# Altium project MB_AUTOMATED_TESTER.PrjPcb
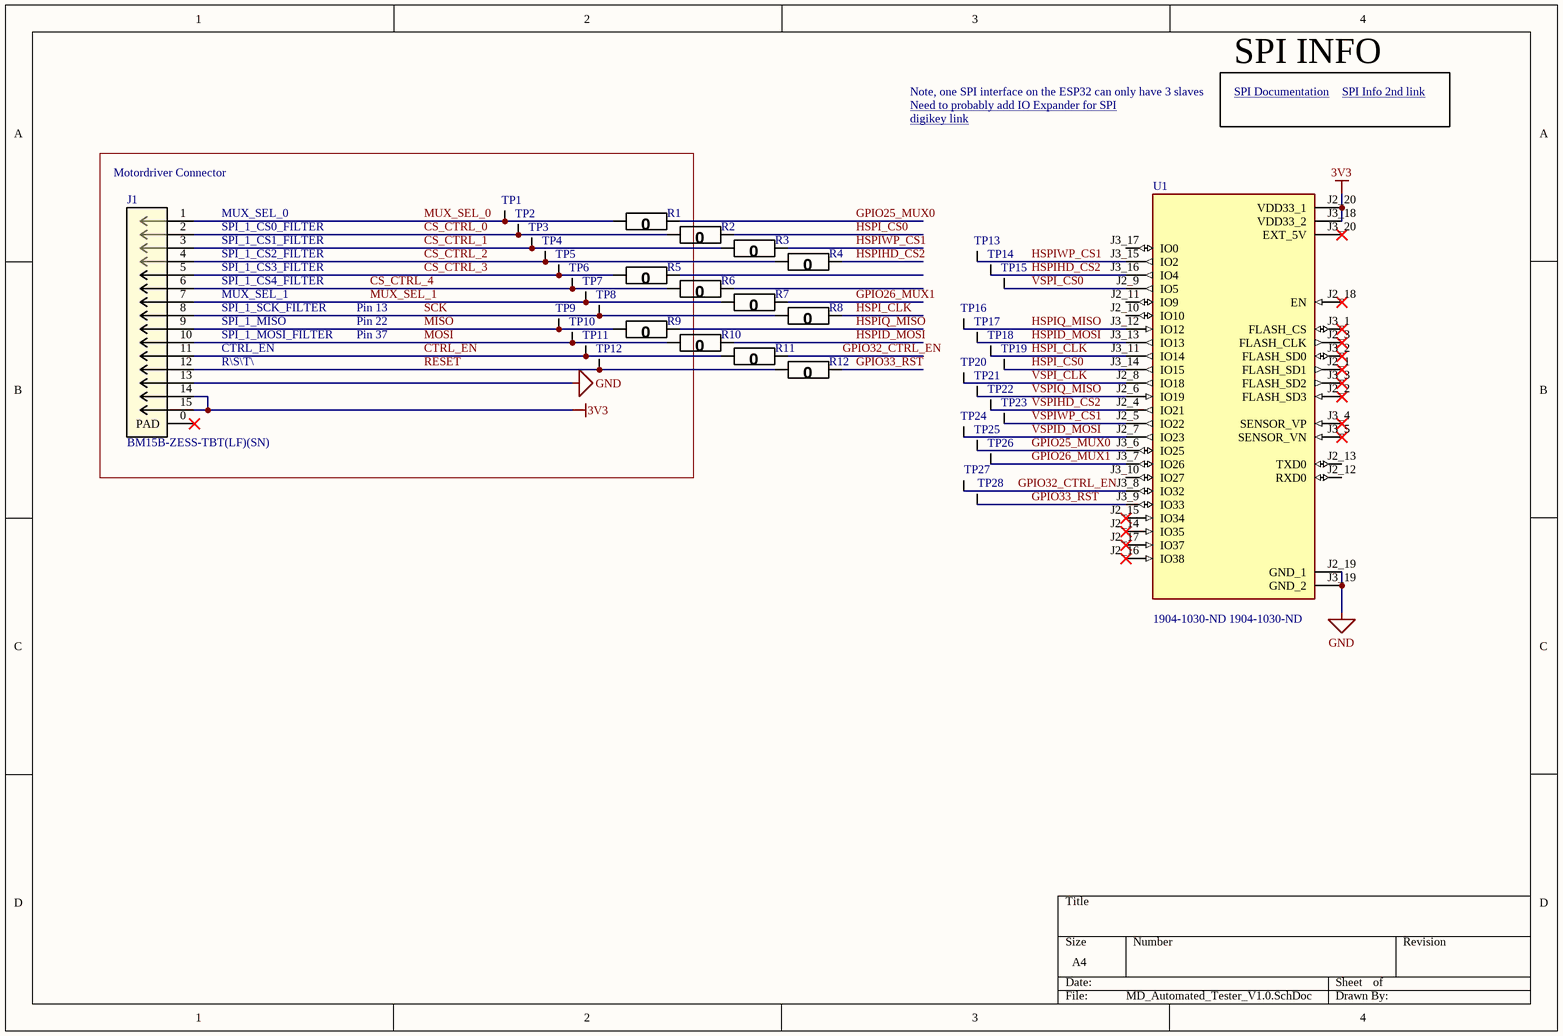
[diagram p0: MD_Automated_Tester_V1.0.SchDoc]
1 sheet, 42 parts. Net scope: global (net labels, ports and power ports of the same name join across sheets).
Board file: MD_Automated_Tester_V1.0.PcbDoc

## Sheet MD_Automated_Tester_V1.0.SchDoc
size A4; SheetNumber: 1; SheetTotal: 1

### Parts
J1  BM15B-ZESS-TBT(LF)(SN)  [JST ZE SMT 15POS]
R1  JUMPER  [0603]  (value not drawn)
R2  JUMPER  [0603]  (value not drawn)
R3  JUMPER  [0603]  (value not drawn)
R4  JUMPER  [0603]  (value not drawn)
R5  JUMPER  [0603]  (value not drawn)
R6  JUMPER  [0603]  (value not drawn)
R7  JUMPER  [0603]  (value not drawn)
R8  JUMPER  [0603]  (value not drawn)
R9  JUMPER  [0603]  (value not drawn)
R10  JUMPER  [0603]  (value not drawn)
R11  JUMPER  [0603]  (value not drawn)
R12  JUMPER  [0603]  (value not drawn)
TP1  Test Point (Via)  [TP]  (value not drawn)  (no BOM)
TP2  Test Point (Via)  [TP]  (value not drawn)  (no BOM)
TP3  Test Point (Via)  [TP]  (value not drawn)  (no BOM)
TP4  Test Point (Via)  [TP]  (value not drawn)  (no BOM)
TP5  Test Point (Via)  [TP]  (value not drawn)  (no BOM)
TP6  Test Point (Via)  [TP]  (value not drawn)  (no BOM)
TP7  Test Point (Via)  [TP]  (value not drawn)  (no BOM)
TP8  Test Point (Via)  [TP]  (value not drawn)  (no BOM)
TP9  Test Point (Via)  [TP]  (value not drawn)  (no BOM)
TP10  Test Point (Via)  [TP]  (value not drawn)  (no BOM)
TP11  Test Point (Via)  [TP]  (value not drawn)  (no BOM)
TP12  Test Point (Via)  [TP]  (value not drawn)  (no BOM)
TP13  Test Point (Via)  [TP]  (value not drawn)  (no BOM)
TP14  Test Point (Via)  [TP]  (value not drawn)  (no BOM)
TP15  Test Point (Via)  [TP]  (value not drawn)  (no BOM)
TP16  Test Point (Via)  [TP]  (value not drawn)  (no BOM)
TP17  Test Point (Via)  [TP]  (value not drawn)  (no BOM)
TP18  Test Point (Via)  [TP]  (value not drawn)  (no BOM)
TP19  Test Point (Via)  [TP]  (value not drawn)  (no BOM)
TP20  Test Point (Via)  [TP]  (value not drawn)  (no BOM)
TP21  Test Point (Via)  [TP]  (value not drawn)  (no BOM)
TP22  Test Point (Via)  [TP]  (value not drawn)  (no BOM)
TP23  Test Point (Via)  [TP]  (value not drawn)  (no BOM)
TP24  Test Point (Via)  [TP]  (value not drawn)  (no BOM)
TP25  Test Point (Via)  [TP]  (value not drawn)  (no BOM)
TP26  Test Point (Via)  [TP]  (value not drawn)  (no BOM)
TP27  Test Point (Via)  [TP]  (value not drawn)  (no BOM)
TP28  Test Point (Via)  [TP]  (value not drawn)  (no BOM)
U1  Supplier Part Number 1: 1904-1030-ND / 1904-1030-ND  [ESP32-PICO-D4-KIT]  (hidden comment: ESP32-PICO-D4-KIT)

### Nets
3V3: J1.14 J1.15 U1.J2_20(VDD33_1) U1.J3_18(VDD33_2)
GND: J1.13 U1.J2_19(GND_1) U1.J3_19(GND_2)
CS_CTRL_0: J1.2 R2.2(R2) TP2.1
CS_CTRL_1: J1.3 R3.2(R2) TP3.1
CS_CTRL_2: J1.4 R4.2(R2) TP4.1
CS_CTRL_3: J1.5 R5.2(R2) TP5.1
CS_CTRL_4: J1.6 R6.2(R2) TP6.1
CTRL_EN: J1.11 R11.2(R2) TP11.1
GPIO25_MUX0: R1.1(R1) TP25.1 U1.J3_6(IO25)
GPIO26_MUX1: R7.1(R1) TP26.1 U1.J3_7(IO26)
GPIO32_CTRL_EN: R11.1(R1) TP27.1 U1.J3_8(IO32)
GPIO33_~{RST}: R12.1(R1) TP28.1 U1.J3_9(IO33)
HSPI_CLK: R8.1(R1) TP18.1 U1.J3_11(IO14)
HSPI_CS0: R2.1(R1) TP19.1 U1.J3_14(IO15)
HSPID_MOSI: R10.1(R1) TP17.1 U1.J3_13(IO13)
HSPIHD_CS2: R4.1(R1) TP14.1 U1.J3_16(IO4)
HSPIQ_MISO: R9.1(R1) TP16.1 U1.J3_12(IO12)
HSPIWP_CS1: R3.1(R1) TP13.1 U1.J3_15(IO2)
MISO: J1.9 R9.2(R2) TP9.1
MOSI: J1.10 R10.2(R2) TP10.1
MUX_SEL_0: J1.1 R1.2(R2) TP1.1
MUX_SEL_1: J1.7 R7.2(R2) TP7.1
RESET: J1.12 R12.2(R2) TP12.1
SCK: J1.8 R8.2(R2) TP8.1
VSPI_CLK: TP20.1 U1.J2_8(IO18)
VSPI_CS0: TP15.1 U1.J2_9(IO5)
VSPID_MOSI: TP24.1 U1.J2_7(IO23)
VSPIHD_CS2: TP22.1 U1.J2_4(IO21)
VSPIQ_MISO: TP21.1 U1.J2_6(IO19)
VSPIWP_CS1: TP23.1 U1.J2_5(IO22)

Not connected (* = marked no-connect by the designer): J1 0(PAD)*; R5 1(R1); R6 1(R1); U1 J2_1(FLASH_SD1)* J2_2(FLASH_SD3)* J2_3(FLASH_CLK)* J2_10(IO10) J2_11(IO9) J2_12(RXD0) J2_13(TXD0) J2_14(IO35)* J2_15(IO34)* J2_16(IO38)* J2_17(IO37)* J2_18(EN)* J3_1(FLASH_CS)* J3_2(FLASH_SD0)* J3_3(FLASH_SD2)* J3_4(SENSOR_VP)* J3_5(SENSOR_VN)* J3_10(IO27) J3_17(IO0) J3_20(EXT_5V)*

### Notes on the sheet
- Need to probably add IO Expander for SPI <https://ww1.microchip.com/downloads/aemDocuments/documents/APID/ProductDocuments/DataSheets/MCP23017-Data-Sheet-DS20001952.pdf>
- Note, one SPI interface on the ESP32 can only have 3 slaves
- SPI Documentation <https://docs.espressif.com/projects/esp-idf/en/release-v3.0/api-reference/peripherals/spi_master.html#:~:text=The%20ESP32%20has%20four%20SPI,write%20to%20the%20flash%20chip.>
- SPI INFO
- SPI Info 2nd link <https://randomnerdtutorials.com/esp32-spi-communication-arduino/#:~:text=an%20SPI%20multiplexer.-,Multiple%20SPI%20Devices%20(same%20bus%2C%20different%20CS%20pin),uses%20a%20different%20CS%20pin.>
- (near J1) Motordriver Connector
- digikey link <https://www.digikey.ca/en/products/detail/microchip-technology/MCP23S17-E-SP/894276>
- SPI_1_CS0_FILTER
- SPI_1_CS1_FILTER
- MUX_SEL_0
- SPI_1_CS2_FILTER
- SPI_1_CS3_FILTER
- SPI_1_CS4_FILTER
- SPI_1_SCK_FILTER
- MUX_SEL_1
- Pin 13
- CTRL_EN
- R\S\T\
- SPI_1_MISO
- SPI_1_MOSI_FILTER
- Pin 37
- Pin 22

### Library data of the parts
J1 = CN 15POS JST ZE SMT: CONN HEADER VERT SMD 15POS ZE; Supplier 1: Digi-Key; Supplier Part Number 1: 455-4211-1-ND; Part Number: CN 15POS JST ZE SMT; Manufacturer Part Number 1: BM15B-ZESS-TBT(LF)(SN); Supplier URL 1: https://www.digikey.ca/en/products/detail/jst-sales-america-inc/BM15B-ZESS-TBT-LF-SN/1886999?s=N4IgTCBcDaIEIFkCMBWOBaAWgUQMq-QBU5CAKAGQDEBKU3AOWpAF0BfIA; Pin Count: 15
R1-R12 = RES 0 JUMPER: RES SMD 0 OHM JUMPER GENERIC 0603; Manufacturer Part Number 1: RK73Z1JTTD; Value: 0; Package: 0805; Part Number: RES 0 JUMPER; Tolerance: N/A; Supplier 1: Digi-Key; Supplier Part Number 1: 2019-RK73Z1JTTDCT-ND; Supplier URL 1: https://www.digikey.ca/en/products/detail/koa-speer-electronics-inc/RK73Z1JTTD/9845478
U1 = ESP32-PICO-D4-KIT: - ESP32-PICO-D4 Transceiver; 802.11 b/g/n (Wi-Fi, WiFi, WLAN), Bluetooth® Smart Ready 4.x Dual Mode 2.4GHz Evaluation Board; Manufacturer Part Number 1: ESP32-PICO-KIT; Supplier 1: Digi-Key; Part Number: ESP32-PICO-D4-KIT; Supplier URL 1: https://www.digikey.ca/en/products/detail/espressif-systems/ESP32-PICO-KIT/9381703
TP1-TP28 = Test Point (Via): Part Number: Test Point (Via)